# EAGLE design Memoire-1.0 (EAGLE 5.10)
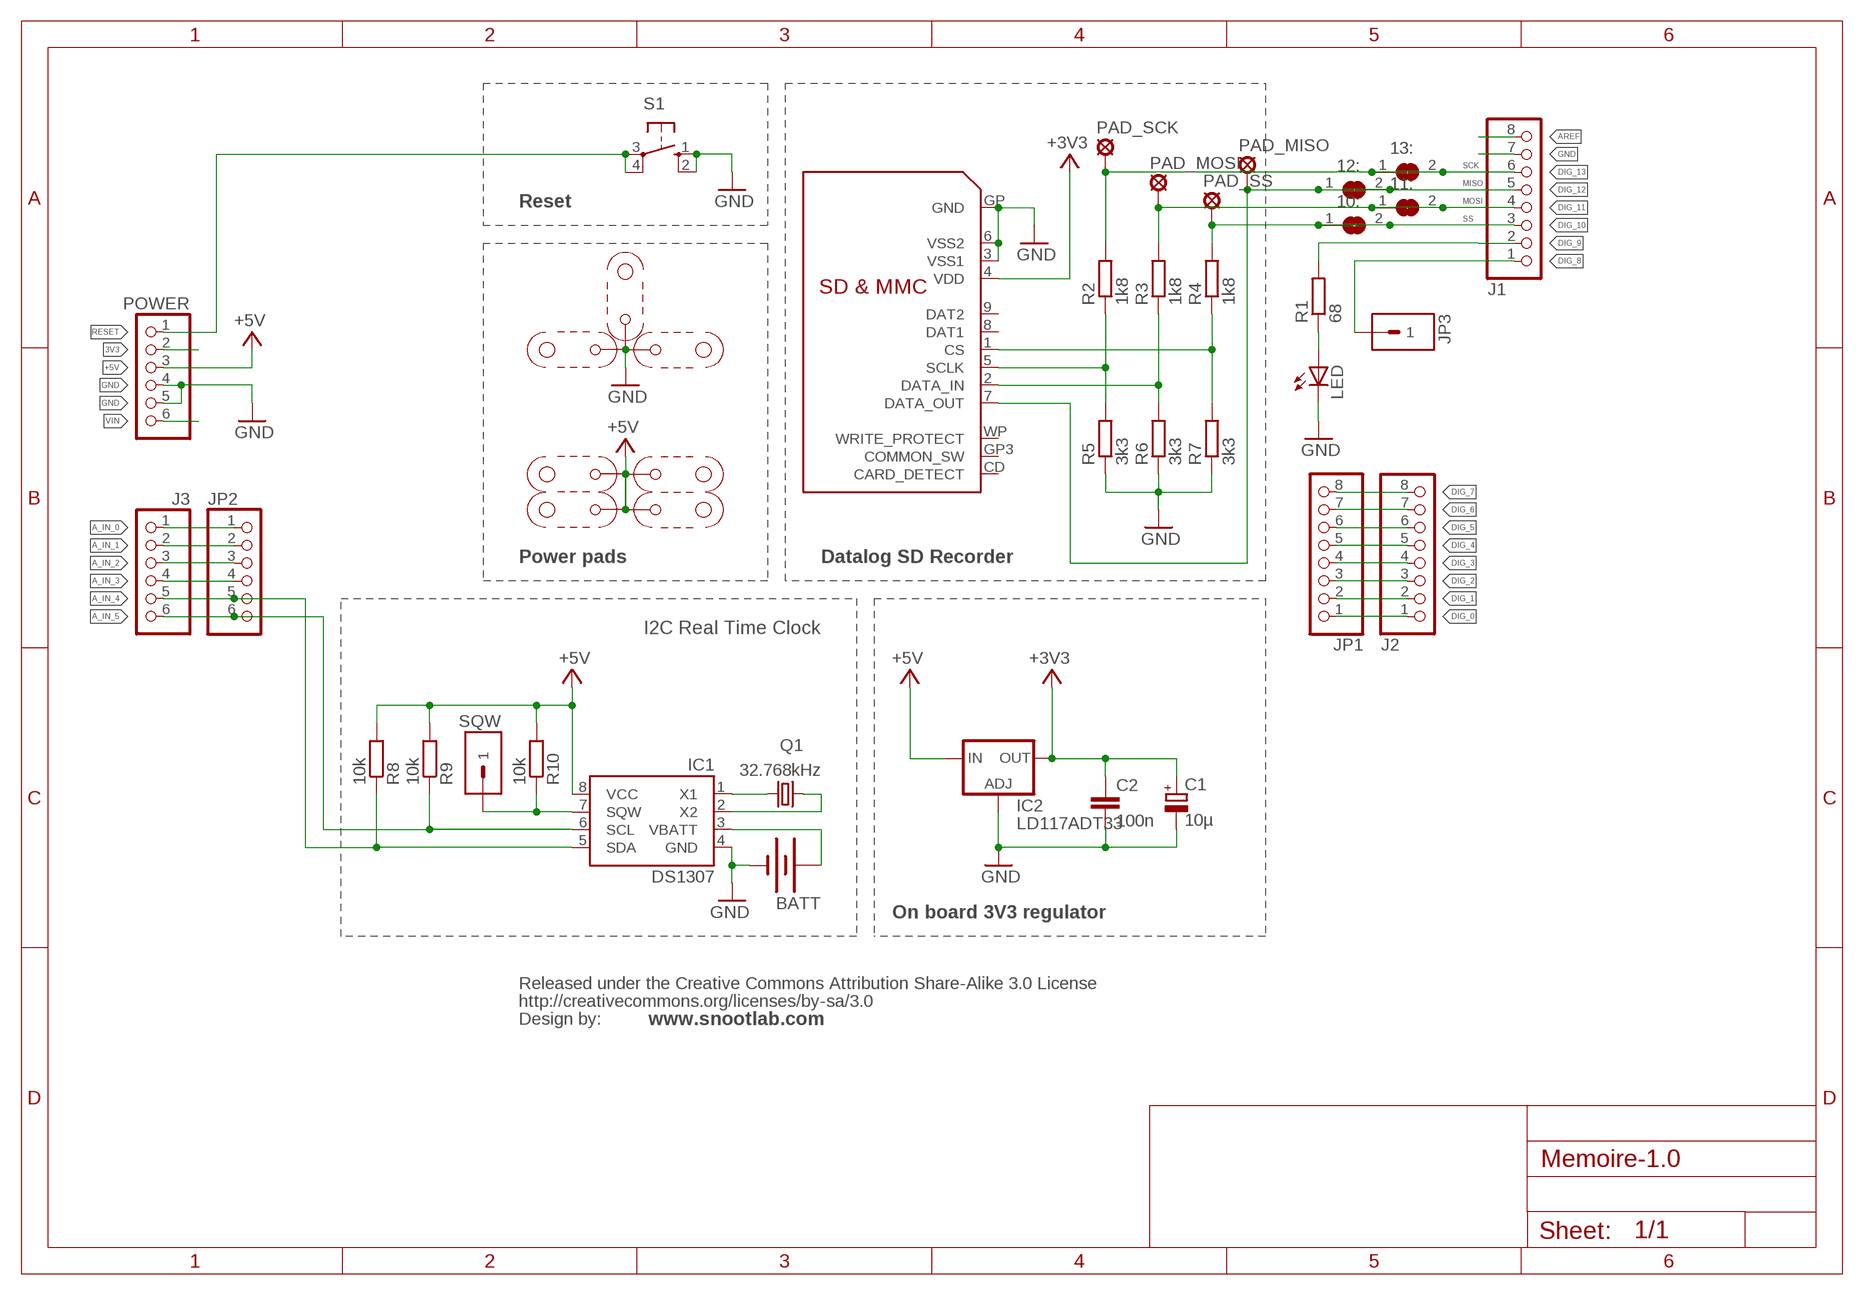
[diagram p0: schematic, sheet 1]

## Parts
10:  SJ  [SJ]
11:  SJ  [SJ]
12:  SJ  [SJ]
13:  SJ  [SJ]
BATT  BATTERY12PTH  [BATTCON_12MM_PTH]
C1  10µ  CPOL-EUE2-5  [E2-5]
C2  100n  C-EU050-025X075  [C050-025X075]
IC1  DS1307  DS1307DIL08  [DIL08-LP]
IC2  LD117ADT33  LD117ADT33TR  [DPACK]
J1  PINHD-1X8/STACK  [1X08_STACK]
J2  PINHD-1X8/STACK  [1X08_STACK]
J3  PINHD-1X6/STACK  [1X06_STACK]
JP1  PINHD-1X8NOPIN  [1X08_NOPIN]
JP2  PINHD-1X6NOPIN  [1X06_NOPIN]
JP3  PINHD-1X1  [1X01_NOPIN]
LED  LED3MM  [LED3MM]
PAD_MISO  LSP10  [LSP10]
PAD_MOSI  LSP10  [LSP10]
PAD_SCK  LSP10  [LSP10]
PAD_SS  LSP10  [LSP10]
POWER  PINHD-1X6/STACK  [1X06_STACK]
Q1  32.768kHz  CRYSTALTC38H  [TC38H]
R1  68  R-EU_0207/7  [0207/7]
R2  1k8  R-EU_0207/2V  [0207/2V]
R3  1k8  R-EU_0207/2V  [0207/2V]
R4  1k8  R-EU_0207/2V  [0207/2V]
R5  3k3  R-EU_0207/7  [0207/7]
R6  3k3  R-EU_0207/7  [0207/7]
R7  3k3  R-EU_0207/7  [0207/7]
R8  10k  R-EU_0207/7  [0207/7]
R9  10k  R-EU_0207/7  [0207/7]
R10  10k  R-EU_0207/7  [0207/7]
S1  10-XX  [B3F-10XX]
SQW  PINHD-1X1  [1X01_NOPIN]
U$2  1X3_STRIP  [1X3_STRIP]
U$3  1X3_STRIP  [1X3_STRIP]
U$4  1X3_STRIP  [1X3_STRIP]
U$5  1X3_STRIP  [1X3_STRIP]
U$6  ADAFRUIT_SDMMC06132  [ADAFRUIT_06132]
U$8  1X3_STRIP  [1X3_STRIP]
U$9  1X3_STRIP  [1X3_STRIP]
U$10  1X3_STRIP  [1X3_STRIP]
U$11  CREATIVE_COMMONS  [CREATIVE_COMMONS]

## Nets
3V3: POWER.2
+3V3: C1.+ C2.1 IC2.4(OUT) U$6.4(VDD)
+5V [usbvcc]: IC1.8(VCC) IC2.3(IN) POWER.3 R8.2 R9.2 R10.2 U$2.1 U$2.2 U$2.3 U$3.1 U$3.2 U$3.3 U$4.1 U$4.2 U$4.3 U$5.1 U$5.2 U$5.3
A_IN_0: J3.1 JP2.1
A_IN_1: J3.2 JP2.2
A_IN_2: J3.3 JP2.3
A_IN_3: J3.4 JP2.4
A_IN_4: IC1.5(SDA) J3.5 JP2.5 R8.1
A_IN_5: IC1.6(SCL) J3.6 JP2.6 R9.1
AREF: J1.8
DIG_0: J2.1 JP1.1
DIG_1: J2.2 JP1.2
DIG_2: J2.3 JP1.3
DIG_3: J2.4 JP1.4
DIG_4: J2.5 JP1.5
DIG_5: J2.6 JP1.6
DIG_6 [gnd]: J2.7 JP1.7
DIG_7: J2.8 JP1.8
DIG_8: J1.1 JP3.1
DIG_9: J1.2 R1.2
DIG_10: 10:.1 10:.2 J1.3 PAD_SS.MP R4.2
DIG_11: 11:.1 11:.2 J1.4 PAD_MOSI.MP R3.2
DIG_12: 12:.1 12:.2 J1.5 PAD_MISO.MP U$6.7(DATA_OUT)
DIG_13: 13:.1 13:.2 J1.6 PAD_SCK.MP R2.2
GND [gnd]: BATT.GND(-) C1.- C2.2 IC1.4(GND) IC2.1(ADJ) J1.7 LED.K(C) POWER.4 POWER.5 R5.1 R6.1 R7.1 S1.1(S) S1.2(S1) U$6.3(VSS1) U$6.6(VSS2) U$6.GP(GND) U$8.1 U$8.2 U$8.3 U$9.1 U$9.2 U$9.3 U$10.1 U$10.2 U$10.3
N$1: BATT.VCC@1(+) IC1.3(VBATT)
N$3: IC1.7(SQW) R10.1 SQW.1
N$4: IC1.2(X2) Q1.1
N$5: IC1.1(X1) Q1.2
N$7: LED.A R1.1
N$8: R2.1 R5.2 U$6.5(SCLK)
N$9: R3.1 R6.2 U$6.2(DATA_IN)
N$10: R4.1 R7.2 U$6.1(CS)
RESET: POWER.1 S1.3(P) S1.4(P1)
VIN [power]: POWER.6
Unconnected: U$6.8(DAT1) U$6.9(DAT2) U$6.CD(CARD_DETECT) U$6.GP3(COMMON_SW) U$6.WP(WRITE_PROTECT)

## Notes on the sheet
- SCK
- MISO
- MOSI
- Reset
- SS
- Power pads | Datalog SD Recorder
- I2C Real Time Clock
- On board 3V3 regulator
- www.snootlab.com

## Library data of the parts
10: 11: 12: 13: = jumper:SJ: SMD solder JUMPER
BATT = SparkFun:BATTERY: Battery Holders Various common sizes : AA, AAA, 20mm coin cell and 12mm coin cell.
C1 = rcl:CPOL-EU: POLARIZED CAPACITOR, European symbol
C2 = rcl:C-EU: CAPACITOR, European symbol
IC1 = SnootLib:DS1307
IC2 = v-reg:LD117A?*: Low drop fixed and adjustable positive voltage regulators 1 A Source: http://www.st.com/stonline/products/literature/ds/7194/ld1117axx.pdf
J1 J2 JP1 = SnootLib:PINHD-1X8: PIN HEADER
J3 JP2 POWER = SnootLib:PINHD-1X6: PIN HEADER
JP3 SQW = SnootLib:PINHD-1X1: 1 pin header
LED = led:LED: LED OSRAM: - CHIPLED LG R971, LG N971, LY N971, LG Q971, LY Q971, LO R971, LY R971 LH N974, LH R974 LS Q976, LO Q976, LY Q976 LO Q996 - Hyper CHIPLED LW Q18S LB Q993, LB Q99A, LB R99A - SideLED LS A670, LO A670, LY A670, LG A670, LP A670 LB A673, LV A673, LT A673, LW A673 LH A674 LY A675 LS A676, LA A676, LO A676, LY A676, LW A676 LS A679, LY A679, LG A679 - Hyper Micro SIDELED® LS Y876, LA Y876, LO Y876, LY Y876 LT Y87S - SmartLED LW L88C, LW L88S LB L89C, LB L89S, LG L890 LS L89K, LO L89K, LY L89K LS L896, LA L896, LO L896, LY L896 - TOPLED LS T670, LO T670, LY T670, LG T670, LP T670 LSG T670, LSP T670, LSY T670, LOP T670, LYG T670 LG T671, LOG T671, LSG T671 LB T673, LV T673, LT T673, LW T673 LH T674 LS T676, LA T676, LO T676, LY T676, LB T676, LH T676, LSB T676, LW T676 LB T67C, LV T67C, LT T67C, LS T67K, LO T67K, LY T67K, LW E67C LS E67B, LA E67B, LO E67B, LY E67B, LB E67C, LV E67C, LT E67C LW T67C LS T679, LY T679, LG T679 LS T770, LO T770, LY T770, LG T770, LP T770 LB T773, LV T773, LT T773, LW T773 LH T774 LS E675, LA E675, LY E675, LS T675 LS T776, LA T776, LO T776, LY T776, LB T776 LHGB T686 LT T68C, LB T68C - Hyper Mini TOPLED® LB M676 - Mini TOPLED Santana® LG M470 LS M47K, LO M47K, LY M47K Source: http://www.osram.convergy.de LUXEON: - LUMILED® LXK2-PW12-R00, LXK2-PW12-S00, LXK2-PW14-U00, LXK2-PW14-V00 LXK2-PM12-R00, LXK2-PM12-S00, LXK2-PM14-U00 LXK2-PE12-Q00, LXK2-PE12-R00, LXK2-PE12-S00, LXK2-PE14-T00, LXK2-PE14-U00 LXK2-PB12-K00, LXK2-PB12-L00, LXK2-PB12-M00, LXK2-PB14-N00, LXK2-PB14-P00, LXK2-PB14-Q00 LXK2-PR12-L00, LXK2-PR12-M00, LXK2-PR14-Q00, LXK2-PR14-R00 LXK2-PD12-Q00, LXK2-PD12-R00, LXK2-PD12-S00 LXK2-PH12-R00, LXK2-PH12-S00 LXK2-PL12-P00, LXK2-PL12-Q00, LXK2-PL12-R00 Source: www.luxeon.com KINGBRIGHT: KA-3528ASYC Source: www.kingbright.com
PAD_MISO PAD_MOSI PAD_SCK PAD_SS = solpad:LSP10: SOLDER PAD drill 1.0 mm, distributor Buerklin, 12H555
Q1 = crystal:CRYSTAL: CRYSTAL
R1-R10 = rcl:R-EU_: RESISTOR, European symbol
S1 = switch-omron:10-XX: OMRON SWITCH
U$2-U$5 U$8-U$10 = SnootLib:1X3_STRIP
U$6 = SnootLib:ADAFRUIT_SDMMC: SD MMC Card holder 4UCON part #06132 - easy to solder
U$11 = SnootLib:CREATIVE_COMMONS

## Net classes
0 default: width 0.254 mm, drill 0.305 mm, clearance 0.152 mm
1 power: width 0.61 mm, drill 0.508 mm, clearance 0.152 mm
2 gnd: width 0.305 mm, drill 0.508 mm, clearance 0.152 mm
3 usbvcc: width 0.508 mm, drill 0.508 mm, clearance 0.152 mm
4 aref: width 0.406 mm

## Board
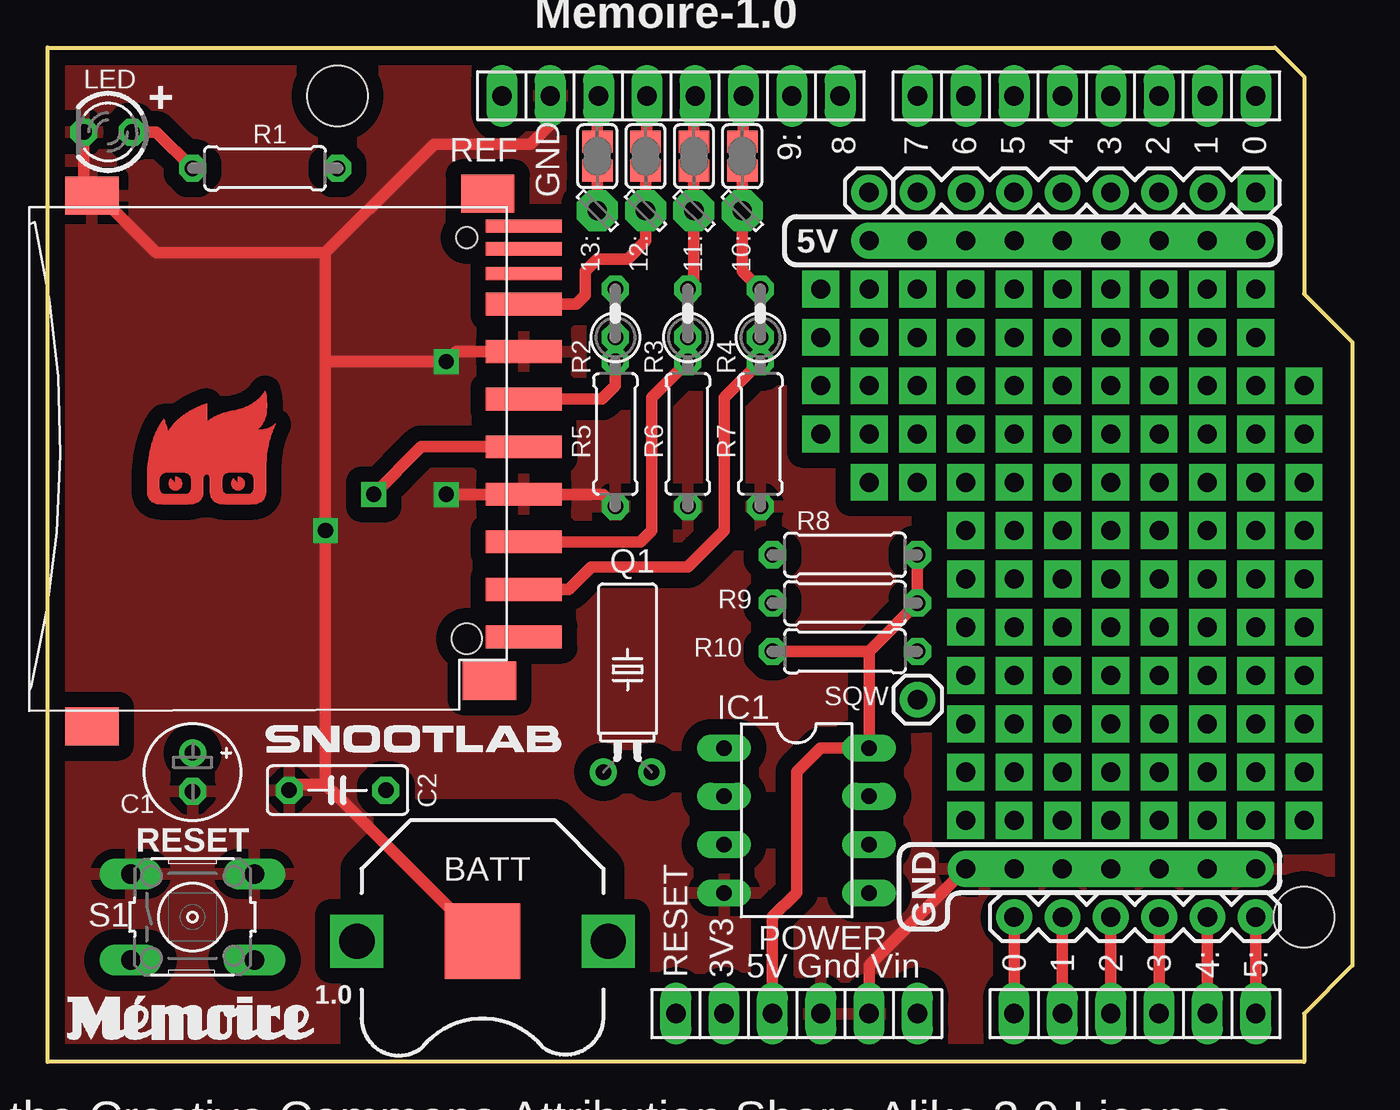
[diagram p1: board, top side]
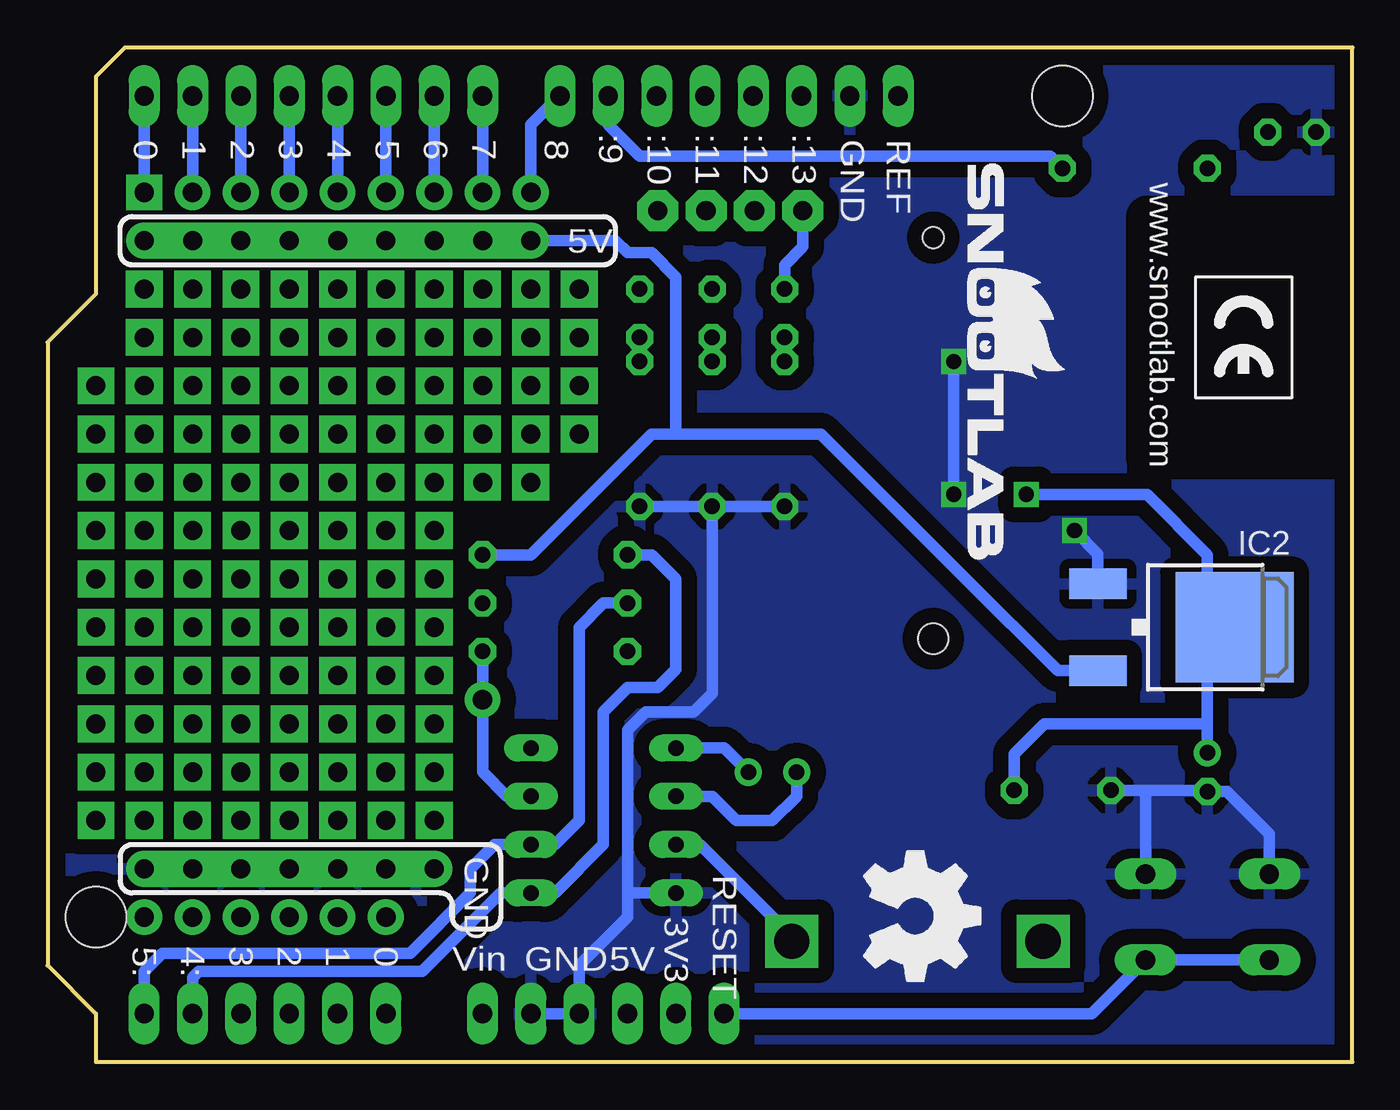
[diagram p2: board, bottom side, seen from below]

Size 68.58 x 53.34 mm. Coordinates in mm from the lower left corner, seen from the top.
Outline: 0,53.34 64.52,53.34 66.04,51.82 66.04,40.39 68.58,37.85 68.58,5.08 66.04,2.54 66.04,0 0,0 0,53.34
Copper layers (1*16): Top 0.035mm / dielectric 1.5mm / Bottom 0.035mm
Design rules "SparkFun *": minimum track width 8mil, minimum drill 20mil, track to track 8mil, track to pad 8mil, pad to pad 8mil, via to via 8mil, smd to smd 8mil, copper to edge 10mil, drill to drill 8mil, minimum pad ring 12mil, minimum via ring 10mil, stop-mask expansion 4mil, vias tented up to drill 25mil, thermal gap 20mil
Holes 3.2 mm at 66.04,7.62 15.24,50.8
bKeepout: 8 lines
tRestrict: area 16.5,0 to 29.2,12.7
bRestrict: area 0,31.8 to 10.8,44.5

### Footprints (pad centres in the part's own frame; a part is rotated, then mirrored left to right if it is on the bottom)
SJ = smd 1.168 x 1.6: 1 -0.762,0; 2 0.762,0
BATTCON_12MM_PTH = smd 3.962 x 3.962: GND 0,0 | drill 1.854 square: VCC@1 -6.604,0; VCC@2 6.604,0
E2-5 = drill 0.813 pad 1.27 round: + -1.016,0 | drill 0.813 pad 1.27 octagon: - 1.016,0
C050-025X075 = drill 0.813 octagon: 1 -2.54,0; 2 2.54,0
DIL08-LP = drill 0.813 long: 1 -3.81,-3.81; 2 -1.27,-3.81; 3 1.27,-3.81; 4 3.81,-3.81; 5 3.81,3.81; 6 1.27,3.81; 7 -1.27,3.81; 8 -3.81,3.81
DPACK = smd 1.6 x 3: 1 -2.28,-4.8; 3 2.28,-4.8 | smd 5.8 x 6.2: 4 0,2.38
1X08_STACK = drill 1.016 long: 1 -8.89,0; 2 -6.35,0; 3 -3.81,0; 4 -1.27,0; 5 1.27,0; 6 3.81,0; 7 6.35,0; 8 8.89,0
1X06_STACK = drill 1.016 long: 1 -6.35,0; 2 -3.81,0; 3 -1.27,0; 4 1.27,0; 5 3.81,0; 6 6.35,0
1X08_NOPIN = drill 1.016 pad 1.88 square: 1 0,0 | drill 1.016 pad 1.88 round: 2 2.54,0; 3 5.08,0; 4 7.62,0; 5 10.16,0; 6 12.7,0; 7 15.24,0; 8 17.78,0
1X06_NOPIN = drill 1.016 pad 1.88 round: 1 0,0; 2 2.54,0; 3 5.08,0; 4 7.62,0; 5 10.16,0; 6 12.7,0
1X01_NOPIN = drill 1.016 pad 1.88 round: 1 0,0
LED3MM = drill 0.813 octagon: A -1.27,0; K 1.27,0
LSP10 = drill 1.016 pad 2.159 octagon: MP 0,0
TC38H = drill 0.813 round: 1 -1.27,0; 2 1.27,0
0207/7 = drill 0.813 octagon: 1 -3.81,0; 2 3.81,0
0207/2V = drill 0.813 octagon: 1 -1.27,0; 2 1.27,0
B3F-10XX = drill 1.016 long: 1 -3.251,2.261; 2 3.251,2.261; 3 -3.251,-2.261; 4 3.251,-2.261
1X3_STRIP = drill 1 pad 1.93 offset: 1 0,0; 3 5.08,0 | drill 1 pad 1.93 long: 2 2.54,0
ADAFRUIT_06132 = smd 1.2 x 4: 1 6.9,0.9; 2 4.4,0.9; 3 1.9,0.9; 4 -0.6,0.9; 5 -3.1,0.9; 6 -5.6,0.9; 7 -8.1,0.9; 9 9.4,0.9 | smd 0.7 x 4: 8 -9.7,0.9; CD -11,0.9; WP -12.2,0.9 | smd 2 x 2.8: GP -13.8,-21.8; GP2 14.1,-21.8; GP3 11.7,-0.9; GP4 -13.9,-1 | hole 1.1: -11.6,-2.1 | hole 1.6: 9.5,-2.1

### Placement (x,y rotation side)
10:  36.51,47.62 90 top
11:  33.97,47.62 90 top
12:  31.43,47.62 90 top
13:  28.89,47.62 90 top
BATT  22.86,6.35 180 top
C1  7.62,15.24 270 top
C2  15.24,14.29 180 top
IC1  39.37,12.7 270 top
IC2  8.57,22.86 270 bottom
J1  32.77,50.8 180 top
J2  54.61,50.8 180 top
J3  57.15,2.54 0 top
JP1  63.5,45.72 180 top
JP2  50.8,7.62 0 top
JP3  43.18,45.72 0 top
LED  3.17,48.9 180 top
PAD_MISO  31.43,44.77 135 top
PAD_MOSI  33.97,44.77 135 top
PAD_SCK  28.89,44.77 135 top
PAD_SS  36.51,44.77 135 top
POWER  39.37,2.54 0 top
Q1  30.48,15.24 0 top
R1  11.43,46.99 0 top
R2  29.84,39.37 90 top
R3  33.66,39.37 90 top
R4  37.47,39.37 90 top
R5  29.84,33.02 90 top
R6  33.66,33.02 90 top
R7  37.47,33.02 90 top
R8  41.91,26.67 0 top
R9  41.91,24.13 0 top
R10  41.91,21.59 180 top
S1  7.62,7.62 0 top
SQW  45.72,19.05 0 top
U$1  [LOGO_SNOOT_H6.35_STOP]  5.08,29.21 0 top
U$2  43.18,43.18 0 top
U$3  48.26,43.18 0 top
U$4  53.34,43.18 0 top
U$5  58.42,43.18 0 top
U$6  24.13,31.75 270 top
U$7  [LOGO_SNOOT_TXT_H1.7]  11.43,16.19 0 top
U$8  48.26,10.16 0 top
U$9  53.34,10.16 0 top
U$10  58.42,10.16 0 top
U$11  0,-8.89 0 top  (outside the outline)
U$12  [LOGO_SNOOT_H6.35_STOP]  31.11,25.72 270 bottom
U$13  [LOGO_SNOOT_H6.35]  5.08,29.21 0 top
U$14  [LOGO_SNOOT_H6.35_COPPER]  5.08,29.21 0 top
U$15  [LOGO_OH_H7]  25.72,11.11 270 bottom
U$100  [CE6.35X5.08_TOP]  8.26,41.27 270 bottom
U$103  [LOGO_SNOOT_FULL_H5]  20.32,47.31 270 bottom

### Tracks (layer width: path | path; a pad name or v marks a point on that pad's centre or on a via)
+3V3  (via drill 0.8)
  Top 0.61: U$6.4 20.92,32.35 19.65,32.35 v17.14,29.84
  Bottom 0.61: C1.+ 7.62,17.46 7.62,17.78 | 7.62,17.78 7.62,21.43 IC2.4 5.08,22.86 7.62,25.4 7.62,26.67 10.79,29.84 v17.14,29.84 | C2.1 17.78,16.19 16.19,17.78 7.62,17.78
+5V
  Top 0.61: POWER.3 38.1,7.62 39.37,8.89 39.37,15.24 40.64,16.51 IC1.8 43.18,21.59 | R9.2 R8.2 R9.2 | 43.18,21.59 39.37,21.59 R10.2 | R9.2 43.18,21.59
  Bottom 0.61: U$2.3 U$3.2 | U$3.2 U$3.3 | U$3.3 U$4.2 | U$4.2 U$5.1 | IC2.3 15.5,20.58 20.32,25.4 22.86,27.94 25.4,30.48 27.94,33.02 35.56,33.02 | 35.56,33.02 36.83,33.02 39.37,30.48 40.64,29.21 43.18,26.67 R8.2 | U$2.3 U$2.1 40.64,43.18 38.73,43.18 38.1,42.55 36.83,42.55 35.56,41.27 35.56,40.64 35.56,33.02 | U$5.1 U$5.2 U$5.3 | U$4.2 U$5.1 | U$3.2 U$3.3 | U$2.3 U$2.2
A_IN_0
  Top 0.61: J3.1 JP2.1
A_IN_1
  Top 0.61: J3.2 JP2.2
A_IN_2
  Top 0.61: J3.3 JP2.3
A_IN_3
  Top 0.61: J3.4 JP2.4
A_IN_4
  Top 0.61: J3.5 JP2.5
  Bottom 0.61: R8.1 36.83,26.67 35.56,25.4 35.56,21.59 35.56,20.64 36.51,19.68 38.1,19.68 39.37,18.41 39.37,17.78 39.37,11.43 41.91,8.89 IC1.5 44.77,8.89 48.9,4.76 60.64,4.76 60.96,4.45 J3.5
A_IN_5
  Top 0.61: J3.6 JP2.6
  Bottom 0.61: R9.1 39.37,24.13 40.64,22.86 40.64,12.7 41.91,11.43 IC1.6 45.09,11.43 46.35,10.16 46.35,8.89 49.53,5.71 62.55,5.71 63.5,4.76 J3.6
DIG_0
  Bottom 0.61: JP1.1 J2.1
DIG_1
  Bottom 0.61: JP1.2 J2.2
DIG_2
  Bottom 0.61: JP1.3 J2.3
DIG_3
  Bottom 0.61: JP1.4 J2.4
DIG_4
  Bottom 0.61: JP1.5 J2.5
DIG_5
  Bottom 0.61: JP1.6 J2.6
DIG_6
  Bottom 0.61: JP1.7 J2.7
DIG_7
  Bottom 0.61: JP1.8 J2.8
DIG_8
  Bottom 0.61: J1.1 43.18,49.28 JP3.1
DIG_9
  Bottom 0.61: J1.2 39.12,49.28 38.1,48.26 37.47,47.62 15.88,47.62 R1.2
DIG_10
  Top 0.254: 10:.1 10:.2
  Top 0.61: 10:.2 36.58,48.39 J1.3 | 36.51,46.67 10:.1 PAD_SS.MP 36.51,41.59 R4.2
DIG_11
  Top 0.254: 11:.1 11:.2
  Top 0.61: J1.4 33.97,50.74 11:.2 | 11:.1 33.66,46.55 11:.1 | 11:.1 PAD_MOSI.MP 33.97,40.96 R3.2
DIG_12
  Top 0.254: 12:.1 12:.2
  Top 0.61: J1.5 31.5,48.64 12:.2 | U$6.7 27.79,39.85 28.26,40.32 28.26,40.96 28.26,41.59 28.89,42.23 30.48,42.23 31.43,43.18 PAD_MISO.MP 31.43,46.55 12:.1
DIG_13
  Top 0.254: 13:.1 13:.2
  Top 0.61: J1.6 28.89,50.74 13:.2 | PAD_SCK.MP 13:.1
  Bottom 0.61: R2.2 29.84,41.91 28.89,42.86 PAD_SCK.MP
GND  (via drill 0.8)
  Top 0.61: J1.7 26.42,49.28 25.4,48.26 20.32,48.26 19.05,46.99 14.61,42.55 | R5.1 29.2,29.85 U$6.3 v20.95,29.84 | LED.K 1.91,45.98 U$6.GP 2.71,45.55 5.08,43.18 5.71,42.55 14.61,42.55 | 14.61,14.61 14.61,16.83 v14.61,27.94 14.61,33.66 14.61,36.83 | 14.61,14.61 15.24,13.97 16.51,12.7 17.78,11.43 BATT.GND | POWER.5 43.18,5.08 U$8.1 U$8.2 | U$8.2 U$8.3 | U$8.3 U$9.2 | U$9.2 U$9.3 | 14.61,14.61 13.02,14.61 C2.2 | U$6.6 21.48,37.35 v20.95,36.83 14.61,36.83 | 14.61,36.83 14.61,42.55 | U$10.3 U$10.2 U$9.3 | U$9.2 U$9.3 | U$8.2 U$8.3
  Bottom 0.61: R5.1 R6.1 | R6.1 R7.1 | 36.83,8.89 IC1.4 36.83,8.89 | POWER.5 POWER.4 40.64,5.08 38.1,7.62 38.1,8.89 | 38.1,8.89 38.1,10.16 38.1,17.46 37.15,18.41 34.61,18.41 33.66,19.37 33.66,22.23 R6.1 | 38.1,8.89 36.83,8.89 | 11.11,14.29 7.68,14.29 C1.- 6.6,14.22 5.08,12.7 4.37,11.99 S1.1 | 11.11,14.29 C2.2 | S1.2 10.87,14.05 11.11,14.29 | IC2.1 13.37,26.71 v14.61,27.94 | v20.95,36.83 v20.95,29.84
  pour Top (isolate 0.813): -1.27,54.61 74.93,54.61 74.93,-1.27 -1.27,-1.27
  pour Bottom (isolate 0.813): -2.54,54.61 76.2,54.61 76.2,-1.27 -2.54,-1.27
N$1
  Bottom 0.61: BATT.VCC@1 29.46,6.6 34.29,11.43 IC1.3
N$2  (via drill 1 pad 1.93)
  other vias: 50.8,22.86
N$3
  Bottom 0.61: IC1.7 44.45,13.97 45.72,15.24 SQW.1 R10.1
N$4
  Bottom 0.61: Q1.1 29.21,13.97 30.48,12.7 32.38,12.7 33.66,13.97 IC1.2
N$5
  Bottom 0.61: Q1.2 33.02,16.51 IC1.1
N$7
  Top 0.61: LED.A 5.71,48.9 R1.1
N$8
  Top 0.61: U$6.5 29.14,34.85 29.84,35.56 R5.2 R2.1
N$9
  Top 0.61: U$6.2 31.16,27.35 31.75,27.94 31.75,34.92 R6.2 R3.1
N$10
  Top 0.61: U$6.1 27.39,24.85 28.57,26.04 33.66,26.04 35.56,27.94 35.56,34.92 R7.2 37.47,37.47 R4.1
N$12  (via drill 1 pad 1.93)
  other vias: 50.8,27.94
N$13  (via drill 1 pad 1.93)
  other vias: 43.18,40.64
N$14  (via drill 1 pad 1.93)
  other vias: 43.18,33.02
N$15  (via drill 1 pad 1.93)
  other vias: 50.8,33.02
N$16  (via drill 1 pad 1.93)
  other vias: 50.8,38.1
N$17  (via drill 1 pad 1.93)
  other vias: 66.04,15.24
N$18  (via drill 1 pad 1.93)
  other vias: 66.04,22.86
N$19  (via drill 1 pad 1.93)
  other vias: 66.04,27.94
N$20  (via drill 1 pad 1.93)
  other vias: 66.04,33.02
N$21  (via drill 1 pad 1.93)
  other vias: 66.04,35.56
N$22  (via drill 1 pad 1.93)
  other vias: 53.34,40.64
N$23  (via drill 1 pad 1.93)
  other vias: 48.26,17.78
N$24  (via drill 1 pad 1.93)
  other vias: 48.26,12.7
N$25  (via drill 1 pad 1.93)
  other vias: 48.26,22.86
N$26  (via drill 1 pad 1.93)
  other vias: 48.26,27.94
N$27  (via drill 1 pad 1.93)
  other vias: 48.26,33.02
N$28  (via drill 1 pad 1.93)
  other vias: 48.26,38.1
N$29  (via drill 1 pad 1.93)
  other vias: 48.26,40.64
N$30  (via drill 1 pad 1.93)
  other vias: 50.8,17.78
N$31  (via drill 1 pad 1.93)
  other vias: 55.88,20.32
N$32  (via drill 1 pad 1.93)
  other vias: 55.88,25.4
N$33  (via drill 1 pad 1.93)
  other vias: 55.88,30.48
N$34  (via drill 1 pad 1.93)
  other vias: 55.88,35.56
N$35  (via drill 1 pad 1.93)
  other vias: 66.04,17.78
N$36  (via drill 1 pad 1.93)
  other vias: 66.04,20.32
N$37  (via drill 1 pad 1.93)
  other vias: 66.04,25.4
N$38  (via drill 1 pad 1.93)
  other vias: 66.04,30.48
N$39  (via drill 1 pad 1.93)
  other vias: 63.5,40.64
N$40  (via drill 1 pad 1.93)
  other vias: 48.26,20.32
N$41  (via drill 1 pad 1.93)
  other vias: 48.26,25.4
N$42  (via drill 1 pad 1.93)
  other vias: 48.26,30.48
N$43  (via drill 1 pad 1.93)
  other vias: 48.26,35.56
N$44  (via drill 1 pad 1.93)
  other vias: 53.34,15.24
N$45  (via drill 1 pad 1.93)
  other vias: 63.5,17.78
N$46  (via drill 1 pad 1.93)
  other vias: 63.5,22.86
N$47  (via drill 1 pad 1.93)
  other vias: 63.5,20.32
N$48  (via drill 1 pad 1.93)
  other vias: 63.5,27.94
N$49  (via drill 1 pad 1.93)
  other vias: 63.5,25.4
N$50  (via drill 1 pad 1.93)
  other vias: 63.5,33.02
N$51  (via drill 1 pad 1.93)
  other vias: 63.5,30.48
N$52  (via drill 1 pad 1.93)
  other vias: 63.5,38.1
N$53  (via drill 1 pad 1.93)
  other vias: 63.5,35.56
N$54  (via drill 1 pad 1.93)
  other vias: 66.04,12.7
N$55  (via drill 1 pad 1.93)
  other vias: 60.96,40.64
N$56  (via drill 1 pad 1.93)
  other vias: 50.8,12.7
N$57  (via drill 1 pad 1.93)
  other vias: 60.96,17.78
N$58  (via drill 1 pad 1.93)
  other vias: 60.96,22.86
N$59  (via drill 1 pad 1.93)
  other vias: 60.96,20.32
N$60  (via drill 1 pad 1.93)
  other vias: 60.96,27.94
N$61  (via drill 1 pad 1.93)
  other vias: 60.96,25.4
N$62  (via drill 1 pad 1.93)
  other vias: 60.96,33.02
N$63  (via drill 1 pad 1.93)
  other vias: 60.96,30.48
N$64  (via drill 1 pad 1.93)
  other vias: 60.96,38.1
N$65  (via drill 1 pad 1.93)
  other vias: 60.96,35.56
N$66  (via drill 1 pad 1.93)
  other vias: 58.42,40.64
N$67  (via drill 1 pad 1.93)
  other vias: 53.34,12.7
N$68  (via drill 1 pad 1.93)
  other vias: 58.42,17.78
N$69  (via drill 1 pad 1.93)
  other vias: 58.42,22.86
N$70  (via drill 1 pad 1.93)
  other vias: 58.42,20.32
N$71  (via drill 1 pad 1.93)
  other vias: 58.42,27.94
N$72  (via drill 1 pad 1.93)
  other vias: 58.42,25.4
N$73  (via drill 1 pad 1.93)
  other vias: 58.42,33.02
N$74  (via drill 1 pad 1.93)
  other vias: 58.42,30.48
N$75  (via drill 1 pad 1.93)
  other vias: 58.42,38.1
N$76  (via drill 1 pad 1.93)
  other vias: 58.42,35.56
N$77  (via drill 1 pad 1.93)
  other vias: 55.88,40.64
N$78  (via drill 1 pad 1.93)
  other vias: 55.88,15.24
N$79  (via drill 1 pad 1.93)
  other vias: 55.88,17.78
N$80  (via drill 1 pad 1.93)
  other vias: 55.88,22.86
N$81  (via drill 1 pad 1.93)
  other vias: 53.34,20.32
N$82  (via drill 1 pad 1.93)
  other vias: 55.88,27.94
N$83  (via drill 1 pad 1.93)
  other vias: 53.34,25.4
N$84  (via drill 1 pad 1.93)
  other vias: 55.88,33.02
N$85  (via drill 1 pad 1.93)
  other vias: 53.34,30.48
N$86  (via drill 1 pad 1.93)
  other vias: 55.88,38.1
N$87  (via drill 1 pad 1.93)
  other vias: 53.34,35.56
N$88  (via drill 1 pad 1.93)
  other vias: 50.8,40.64
N$89  (via drill 1 pad 1.93)
  other vias: 58.42,15.24
N$90  (via drill 1 pad 1.93)
  other vias: 53.34,17.78
N$91  (via drill 1 pad 1.93)
  other vias: 53.34,22.86
N$92  (via drill 1 pad 1.93)
  other vias: 53.34,27.94
N$93  (via drill 1 pad 1.93)
  other vias: 53.34,33.02
N$94  (via drill 1 pad 1.93)
  other vias: 53.34,38.1
N$95  (via drill 1 pad 1.93)
  other vias: 55.88,12.7
N$96  (via drill 1 pad 1.93)
  other vias: 50.8,15.24
N$97  (via drill 1 pad 1.93)
  other vias: 50.8,20.32
N$98  (via drill 1 pad 1.93)
  other vias: 50.8,25.4
N$99  (via drill 1 pad 1.93)
  other vias: 50.8,30.48
N$100  (via drill 1 pad 1.93)
  other vias: 50.8,35.56
N$101  (via drill 1 pad 1.93)
  other vias: 58.42,12.7
N$102  (via drill 1 pad 1.93)
  other vias: 60.96,15.24
N$103  (via drill 1 pad 1.93)
  other vias: 63.5,15.24
N$104  (via drill 1 pad 1.93)
  other vias: 60.96,12.7
N$105  (via drill 1 pad 1.93)
  other vias: 63.5,12.7
N$106  (via drill 1 pad 1.93)
  other vias: 43.18,30.48
N$107  (via drill 1 pad 1.93)
  other vias: 43.18,38.1
N$108  (via drill 1 pad 1.93)
  other vias: 43.18,35.56
N$109  (via drill 1 pad 1.93)
  other vias: 45.72,40.64
N$110  (via drill 1 pad 1.93)
  other vias: 45.72,33.02
N$111  (via drill 1 pad 1.93)
  other vias: 48.26,15.24
N$112  (via drill 1 pad 1.93)
  other vias: 45.72,30.48
N$113  (via drill 1 pad 1.93)
  other vias: 45.72,38.1
N$114  (via drill 1 pad 1.93)
  other vias: 45.72,35.56
N$116  (via drill 1 pad 1.93)
  other vias: 40.64,40.64
N$117  (via drill 1 pad 1.93)
  other vias: 40.64,38.1
N$118  (via drill 1 pad 1.93)
  other vias: 40.64,35.56
N$119  (via drill 1 pad 1.93)
  other vias: 40.64,33.02
RESET
  Bottom 0.61: POWER.1 30.48,2.54 13.97,2.54 13.69,2.54 S1.4 S1.3

### Text on the board
bPlace: www.snootlab.com
tNames: + | REF | 8 | 7 | 6 | 5 | 4 | 3 | 2 | 1 | 0 | 9: | GND | 5V | RESET | GND | 0 | 1 | 2 | 3 | 1.0 | RESET | 3V3 | 5V Gnd Vin | 4: | 5: | www.snootlab.com
bNames: REF | GND | :13 | :12 | :11 | :10 | :9 | 8 | 7 | 6 | 5 | 4 | 3 | 2 | 1 | 0 | 5V | GND | RESET | 3V3 | 0 | 1 | 2 | 3 | 4: | 5: | 5V | GND | Vin
bStop: 1